# EAGLE design 433TMP (EAGLE 7.1.0)
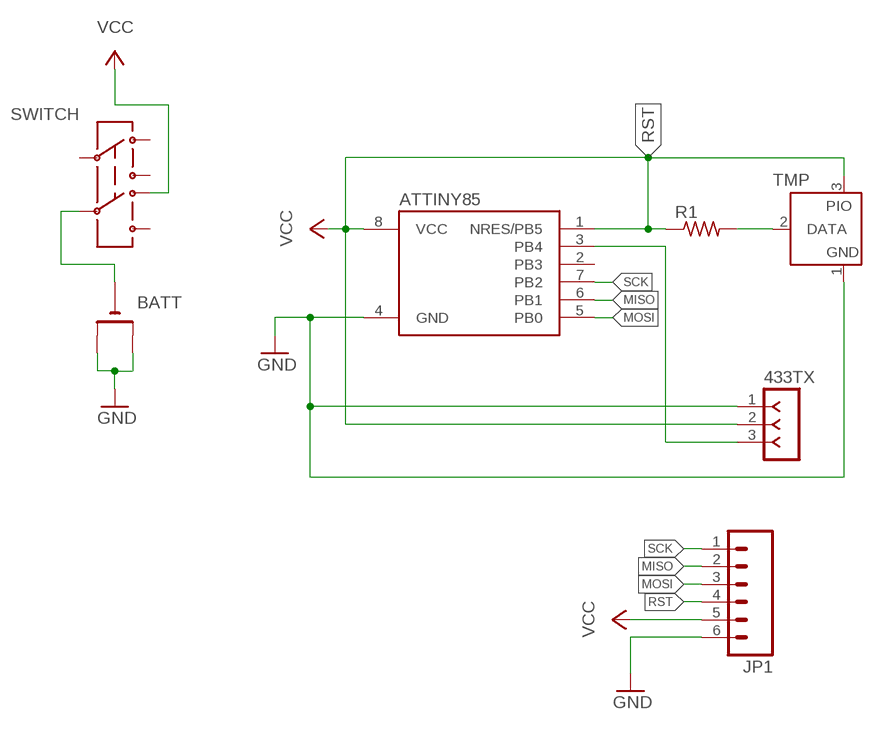
[diagram p0: schematic, sheet 1]

## Parts
433TX  F-1X03-SIP-100-40  [SIP-100-03-40]
ATTINY85  ATTINY85-S  [SOIC8_EIAJ_208MIL]
BATT  CR2032SMT  [CR2032-SMD]
JP1  M06SILK_FEMALE_PTH  [1X06]
R1  R-US_R0805  [R0805]
SWITCH  AYZ0202  [AYZ0202]
TMP  DS2405  [TO92-]

## Nets
GND: 433TX.1 ATTINY85.4(GND) BATT.+$1(+) BATT.+$2(+1) JP1.6 TMP.1(GND)
MISO: ATTINY85.6(PB1) JP1.2
MOSI: ATTINY85.5(PB0) JP1.3
N$1: 433TX.3 ATTINY85.3(PB4)
N$3: R1.2 TMP.2(DATA)
N$5: BATT.- SWITCH.5
RST: 433TX.2 ATTINY85.1(NRES/PB5) ATTINY85.8(VCC) JP1.4 JP1.5 R1.1 SWITCH.6 TMP.3(PIO) ; supply symbol labelled VCC
SCK: ATTINY85.7(PB2) JP1.1
Unconnected: ATTINY85.2(PB3) SWITCH.1 SWITCH.2 SWITCH.3 SWITCH.4

## Library data of the parts
433TX = con-headers-jp:F-1X03-: FEMALE HEADER
ATTINY85 = _hhn_attiny25_45_85:ATTINY85*: ATMEL ATtiny 85 Packages: P = PDIP 08 30mil S = SOIC 08 EIAJ 208mil Technologies Note: for complete ordering code (temp. range, finish, tape&reel etc.) see www.atmel.com • Supply Voltage: V = (1.8…5.5)V | [blank] = (2.7…5.5)V • Speed: 10 = 10 MHz | 20 = 20 MHz Author: Dipl.-Ing. FH Rainer Bayer HHN Hochschule Heilbronn (Heilbronn University), rainer.bayer@hs-heilbronn.de Ingenieurbüro ing-rb, mail@ing-rb.de
BATT = adafruit:CR2032
JP1 = sparkFun-Connectors:M06: Header 6 Standard 6-pin 0.1" header. Use with straight break away headers (SKU : PRT-00116), right angle break away headers (PRT-00553), swiss pins (PRT-00743), machine pins (PRT-00117), and female headers (PRT-00115). Molex polarized connector foot print use with SKU : PRT-08094 with associated crimp pins and housings. NOTES ON THE VARIANTS LOCK and LOCK_LONGPADS... This footprint was designed to help hold the alignment of a through-hole component (i.e. 6-pin header) while soldering it into place. You may notice that each hole has been shifted either up or down by 0.005 of an inch from it's more standard position (which is a perfectly straight line). This slight alteration caused the pins (the squares in the middle) to touch the edges of the holes. Because they are alternating, it causes a "brace" to hold the component in place. 0.005 has proven to be the perfect amount of "off-center" position when using our standard breakaway headers. Although looks a little odd when you look at the bare footprint, once you have a header in there, the alteration is very hard to notice. Also,if you push a header all the way into place, it is covered up entirely on the bottom side. This idea of altering the position of holes to aid alignment will be further integrated into the Sparkfun Library for other footprints. It can help hold any component with 3 or more connection pins.; PROD_ID: CONN-08437
R1 = resistor:R-US_: RESISTOR, American symbol
SWITCH = sparkFun-Electromechanical:AYZ0202: SPDT Slide Switch Simple SMD single-pull double-throw slide switch. Good for less than 350mA power switch, switching UARTs between devices, etc. Spark Fun Electronics SKU : COM-00597; PROD_ID: SWCH-08179
TMP = maxim:DS2405: Addressable Switch DALLAS Semiconductor; MF: DALLAS SEMICONDUCTOR; MPN: DS2405; OC_FARNELL: 1188025; OC_NEWARK: 06F4645

## Board
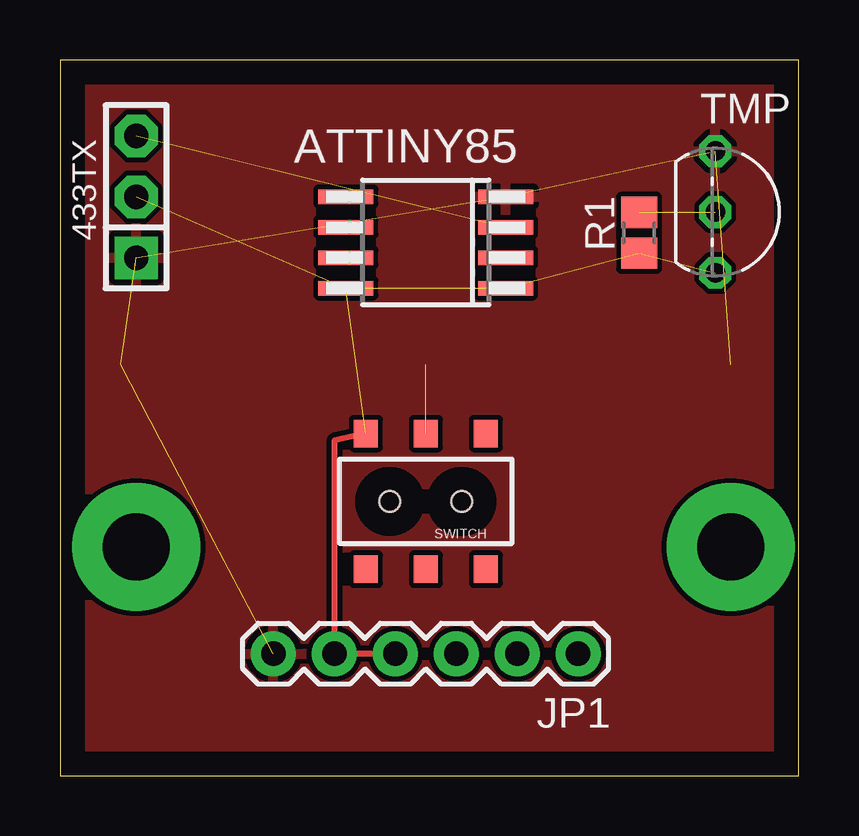
[diagram p1: board, top side]
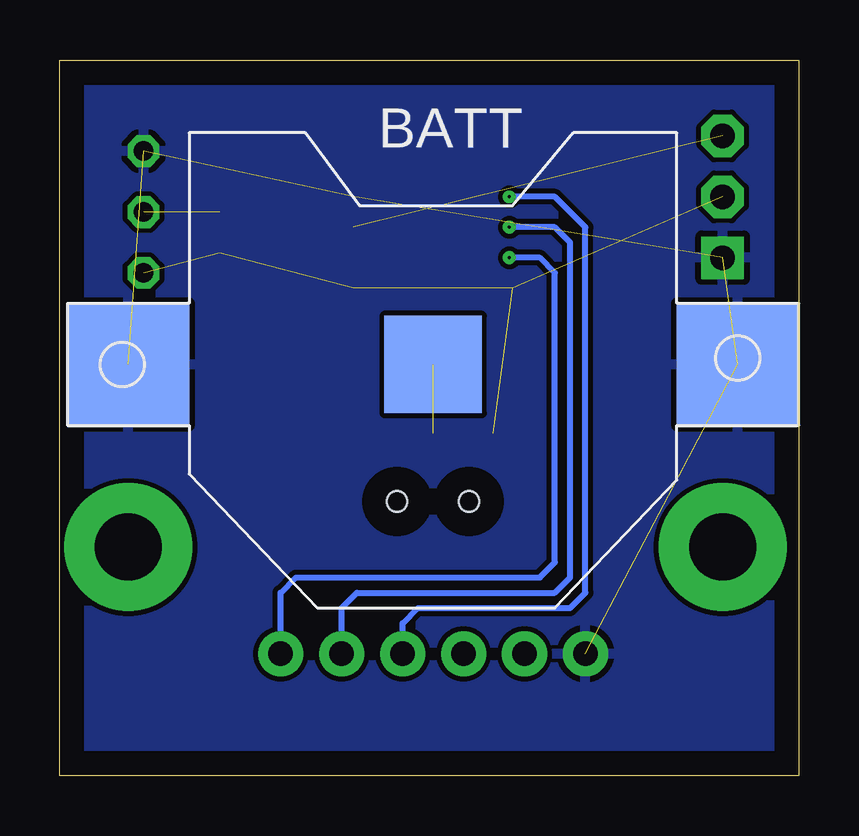
[diagram p2: board, bottom side, seen from below]

Size 30.79 x 29.84 mm. Coordinates in mm from the lower left corner, seen from the top.
Outline: 0,0 30.79,0 30.79,29.84 0,29.84 0,0
Copper layers (1*16): Top 0.035mm / dielectric 1.5mm / Bottom 0.035mm
Design rules "default": minimum track width 10mil, minimum drill 24mil, track to track 8mil, track to pad 8mil, pad to pad 8mil, via to via 8mil, smd to smd 8mil, copper to edge 40mil, drill to drill 8mil, minimum pad ring 10mil, minimum via ring 8mil, stop-mask expansion 4mil, vias tented up to drill 0mil, thermal gap 10mil

### Footprints (pad centres in the part's own frame; a part is rotated, then mirrored left to right if it is on the bottom)
SIP-100-03-40 = drill 1.016 pad 1.778 square: 1 -2.54,0 | drill 1.016 pad 1.778 octagon: 2 0,0; 3 2.54,0
SOIC8_EIAJ_208MIL = smd 0.6 x 2.286: 1 -1.905,-3.33; 2 -0.635,-3.33; 3 0.635,-3.33; 4 1.905,-3.33; 5 1.905,3.33; 6 0.635,3.33; 7 -0.635,3.33; 8 -1.905,3.33
CR2032-SMD = smd 5.08 x 5.08: +$1 -12.7,0; +$2 12.7,0 | smd 4.064 x 4.064: - 0,0
1X06 = drill 1.016 pad 1.88: 1 0,0; 2 2.54,0; 3 5.08,0; 4 7.62,0; 5 10.16,0; 6 12.7,0
R0805 = smd 1.3 x 1.5: 1 -0.85,0; 2 0.85,0
AYZ0202 = smd 1 x 1.15: 1 -2.5,2.825; 2 0,2.825; 3 2.5,2.825; 4 -2.5,-2.825; 5 0,-2.825; 6 2.5,-2.825 | hole 0.85: 1.5,0; -1.5,0
TO92- = drill 0.813 octagon: 1 -2.54,0; 2 0,0; 3 2.54,0

### Placement (x,y rotation side)
433TX  3.17,24.13 90 top
ATTINY85  15.24,22.23 90 top
BATT  15.24,17.14 0 bottom
JP1  21.59,5.08 180 top
R1  24.13,22.63 90 top
SWITCH  15.24,11.43 180 top
TMP  27.3,23.5 270 top

### Tracks (layer width: path | path; a pad name or v marks a point on that pad's centre or on a via)
GND  (5 unrouted)
  pour Top: -2.54,32.38 33.02,32.38 33.02,-1.91 -2.54,-1.91
  pour Bottom: -1.27,31.11 31.75,31.11 31.75,-0.64 -1.27,-0.64
MISO  (via drill 0.13 pad 0.25)
  Top 0.254: v12.06,22.86 ATTINY85.6
  Bottom 0.254: v12.06,22.86 10.16,22.86 9.53,22.23 9.53,8.26 10.16,7.62 18.41,7.62 19.05,6.99 JP1.2
MOSI  (via drill 0.13 pad 0.25)
  Top 0.254: v12.06,24.13 ATTINY85.5
  Bottom 0.254: v12.06,24.13 10.16,24.13 8.89,22.86 8.89,7.62 9.53,6.99 15.88,6.99 16.51,6.35 JP1.3
N$1  (1 unrouted)
N$2  (via drill 2.79 pad 5.33)
  other vias: 27.94,9.53
N$3  (1 unrouted)
N$4  (via drill 2.79 pad 5.33)
  other vias: 3.17,9.53
N$5  (1 unrouted)
RST  (5 unrouted)
  Top 0.254: JP1.4 JP1.5 11.43,13.97 SWITCH.6
SCK  (via drill 0.13 pad 0.25)
  Top 0.254: v12.06,21.59 ATTINY85.7
  Bottom 0.254: v12.06,21.59 10.79,21.59 10.16,20.95 10.16,8.89 10.79,8.26 20.95,8.26 21.59,7.62 JP1.1